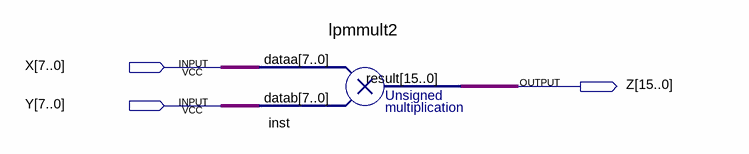
[diagram p0: schematic sheet]
// Quartus schematic multiple.bdf as structural Verilog: 1 symbols, 3 pins
module multiple (
  input  [7:0] X,
  input  [7:0] Y,
  output [15:0] Z
);

  lpmmult2 inst (.dataa(X), .datab(Y), .result(Z));
endmodule
